# EasyEDA Pro project 2024年省赛.eprj

# Schematic Schematic1
Create Date: 2024-07-31; Page Name: P1; Project Name: 2024年省赛; Schematic Name: Schematic1; Update Date: 2024-08-01; Company: 嘉立创EDA; Page Size: A4; Version: V1.0
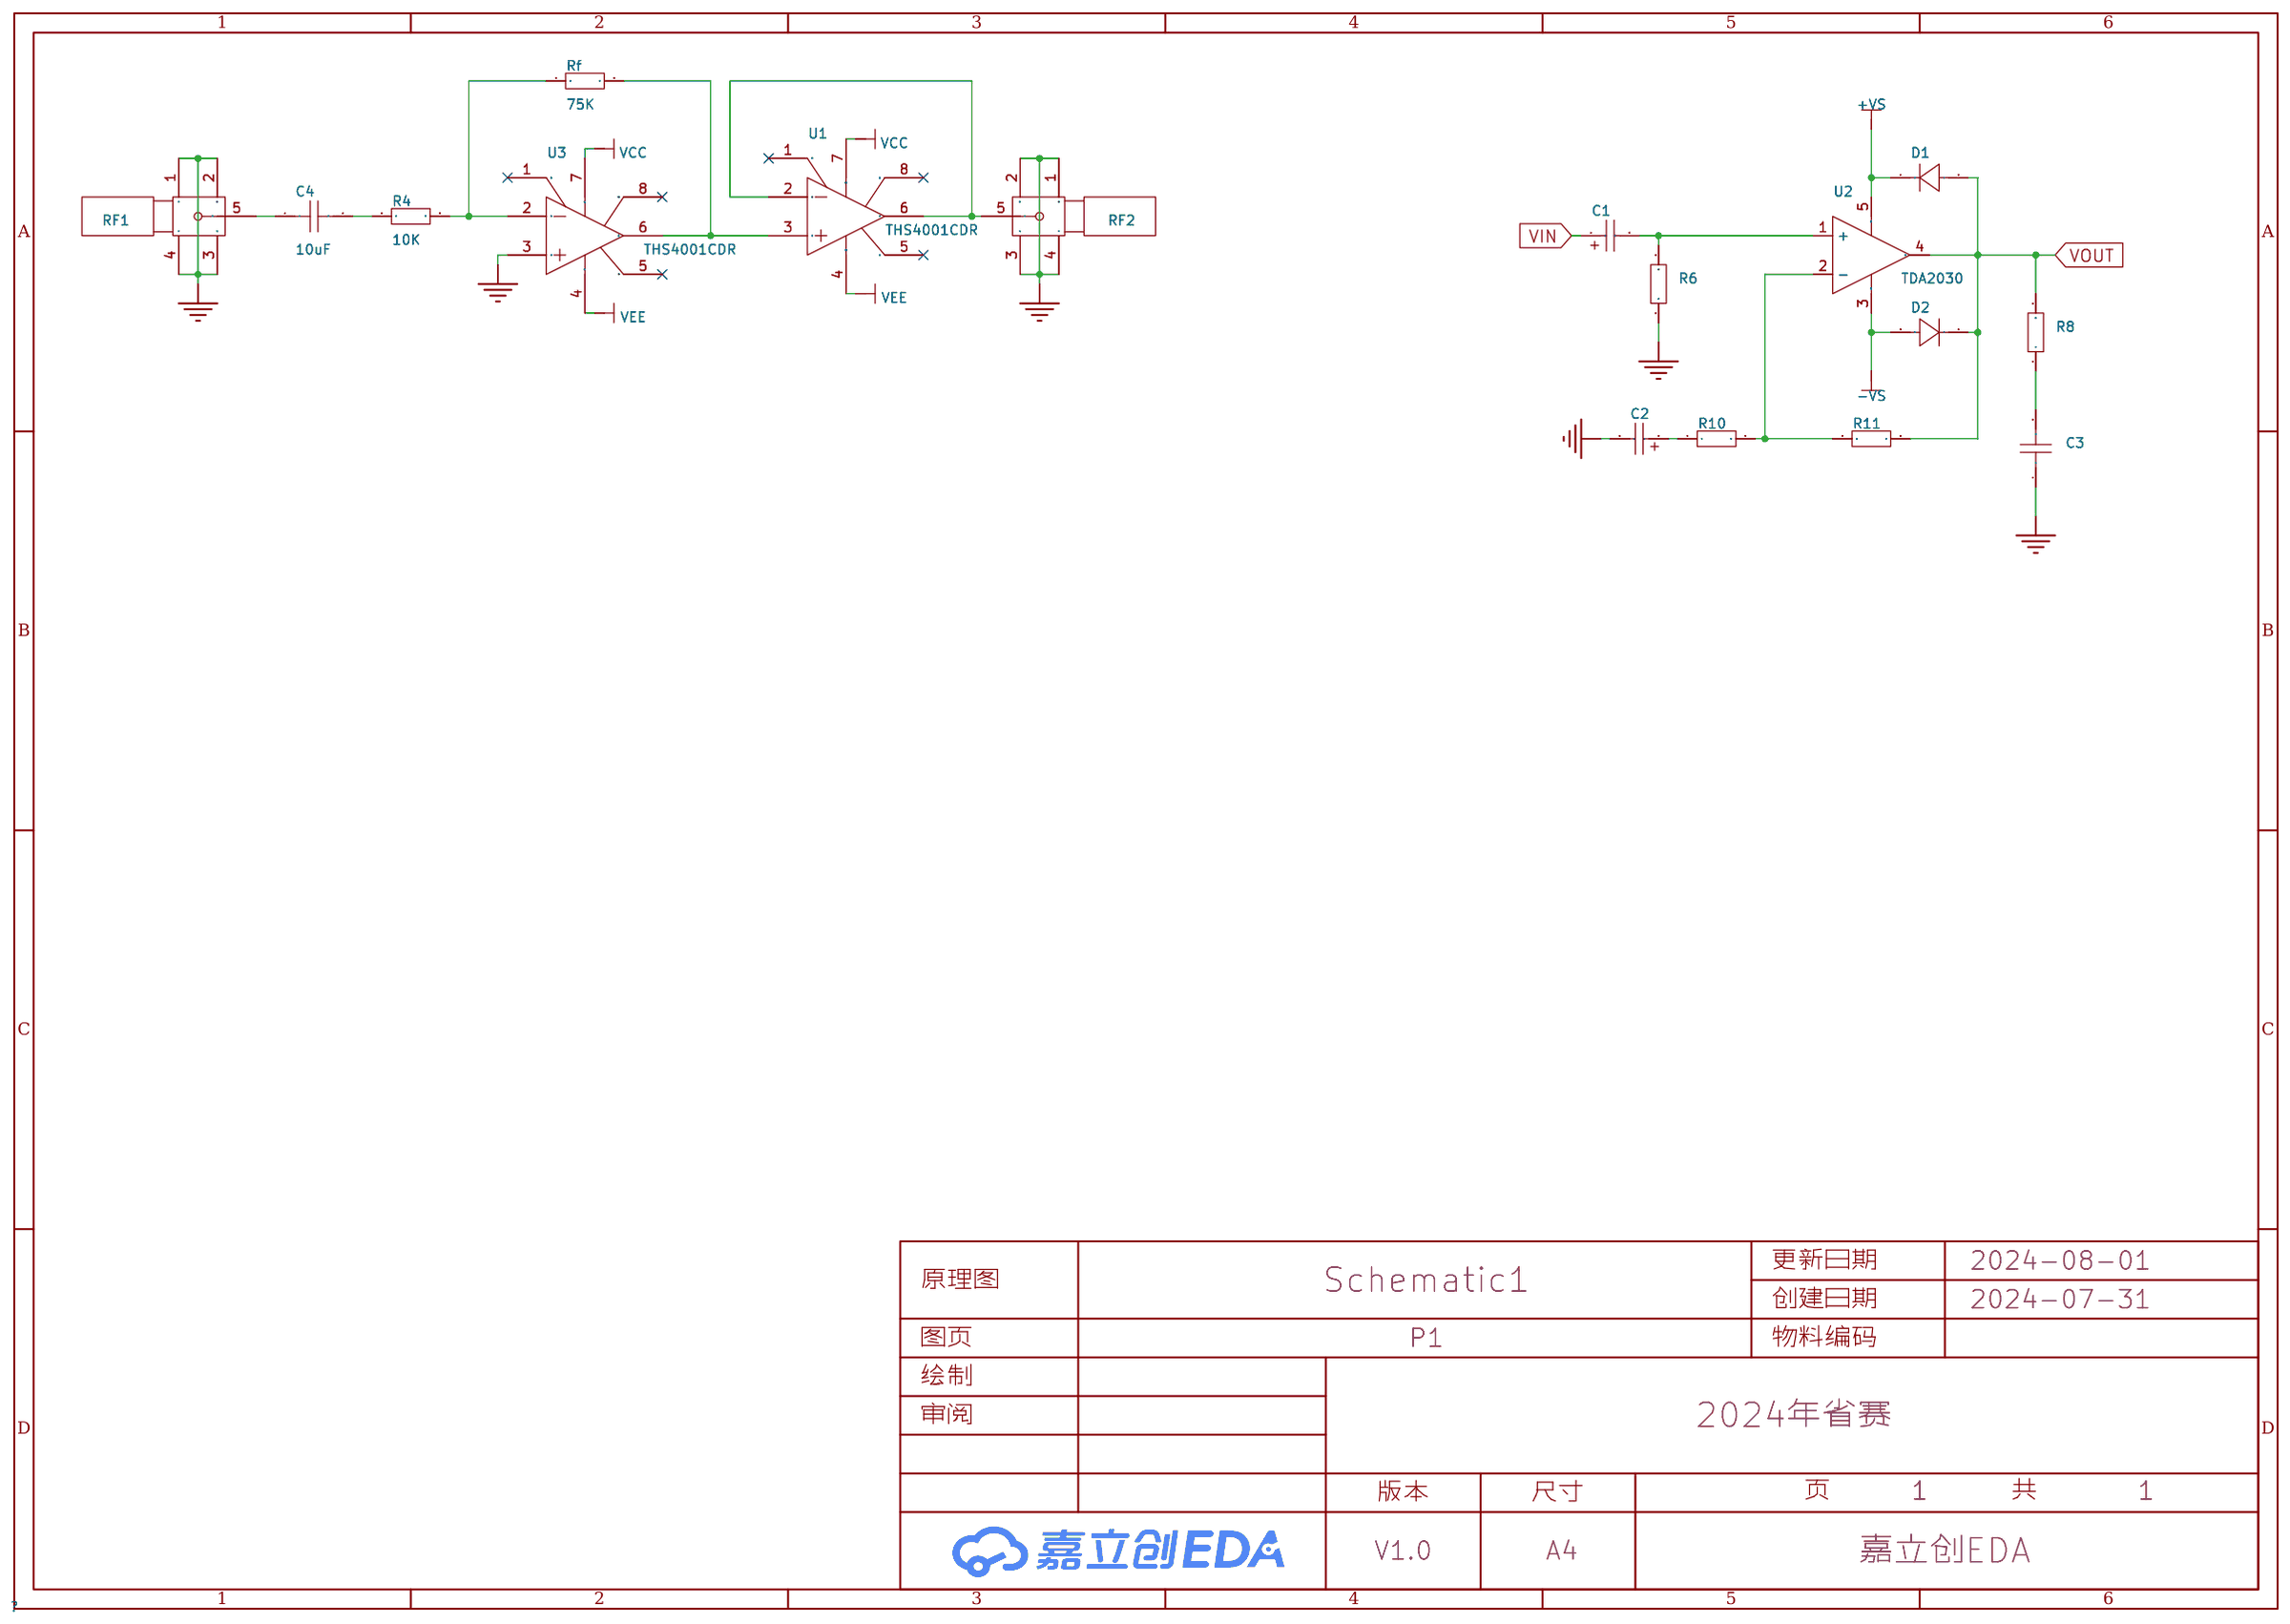
[diagram p0: schematic sheet]

## Parts
C1  1uF  [CAP-SMD_L3.2-W1.6-RD-C7171]
C2  22uF  [C_Ele_SMD_3x5.4mm]
C3  220n  [C0603]
C4  10uF  [C0603]
D1  -  [DO_1N4007]
D2  -  [DO_1N4007]
R4  10K  [R0603]
R6  22K  [R0603]
R8  1  [R0603]
R10  680  [R0603]
R11  10K  [R0603]
Rf  75K  [R0603]
RF1  BWSMA-KE-P001  [SMA-SMD_BWSMA-KE-P001]
RF2  BWSMA-KE-P001  [SMA-SMD_BWSMA-KE-P001]
U1  THS4001CDR  [SOIC-8_L4.9-W3.9-P1.27-LS6.0-BL]
U2  TDA2030  [TO-220-5_L10.2-W4.8-P1.70-TL]
U3  THS4001CDR  [SOIC-8_L4.9-W3.9-P1.27-LS6.0-BL]

## Library data of the parts
C1 = TAJA106K016RNJ: 容值:10uF;精度:±10%;额定电压:16V;等效串联电阻:3Ω@100kHz;; LCSC Part Name: 10uF ±10% 16V; Supplier Part: C7171; Manufacturer: Kyocera AVX; Supplier Footprint: CASE-A-3216; JLCPCB Part Class: Basic Part; Datasheet: https://atta.szlcsc.com/upload/public/pdf/source/20160107/1457707750344.pdf; Supplier: LCSC; Tolerance: ±10%; Rated Voltage: 16V; Equivalent Series Resistance(ESR): 3Ω@100kHz; Operating Temperature: -55℃~+125℃
C2 = C_Ele_SMD_3x5.4mm: Supplier Footprint: SMD,3x5.4mm
C3 C4 = CAP_0603: Supplier Footprint: 0603
D1 D2 = D_1N4007A: Supplier Footprint: DO-41
R4 R6 R8 R10 R11 Rf = Res_0603: Supplier Footprint: 0603
RF1 RF2 = BWSMA-KE-P001: 连接器类型:板端;接口类型:内孔;端口数量:1;接口直径:5.2mm;接口长度/高度:-;频率-最大值:-;射频系列:SMA;阻抗:50Ω;样式:偏脚;工作温度范围:-;; LCSC Part Name: 内孔 SMA 偏脚; Supplier Part: C496550; Manufacturer: BAT WIRELESS(蝙蝠无线); Supplier Footprint: 插件; JLCPCB Part Class: Extended Part; Datasheet: https://atta.szlcsc.com/upload/public/pdf/source/20240320/28FD502871C976DFF213ABFCF2A0ED51.pdf; Supplier: LCSC; Connector Type: 板端; Interface Type: 内孔; Number of Ports: 1; Interface Diameter: 5.2mm; RF Series: SMA; Impedance: 50Ω; Style: 偏脚
U1 U3 = THS4001CDR: 放大器数:单路;增益带宽积(GBP):270MHz;输入偏置电流(Ib):2.6uA;压摆率(SR):400V/us;带宽(-3db):270MHz;; Supplier Part: C2060779; Manufacturer: TI(德州仪器); Supplier Footprint: SOIC-8; JLCPCB Part Class: 扩展库; Datasheet: https://www.ti.com/cn/lit/gpn/ths4001; Supplier: LCSC; Number of Circuits: 单路; Gain Bandwidth Product(GBP): 270MHz; Current - Input Bias(Ib): 2.6uA; Slew Rate(SR): 400V/us; Output Current: 100mA; -3db Bandwidth: 270MHz; Operating Temperature: 0℃~+70℃
U2 = TDA2030_C5296731: TDA2030AL-TB5-T TDA2030 TDA2030L-TB5-T TFA2050; LCSC Part Name: TDA2030A; Supplier Part: C5296731; Manufacturer: JSMSEMI(杰盛微); Supplier Footprint: FZIP5; JLCPCB Part Class: 扩展库; Datasheet: https://atta.szlcsc.com/upload/public/pdf/source/20240105/2117F205BDD887DF1502453718A0C1E3.pdf; Supplier: LCSC

## Nets
GND: C2.2 C3.1 R6.1 RF1.1 RF1.2 RF1.3 RF1.4 RF2.1 RF2.2 RF2.3 RF2.4 U3.3(IN+)
VCC: U1.7(VCC+) U3.7(VCC+)
VEE: U1.4(VCC-) U3.4(VCC-)
VIN: C1.1
+VS: D1.1(K) U2.5(VCC+)
-VS: D2.2(A) U2.3(GND)
VOUT: D1.2(A) D2.1(K) R8.2 R11.2 U2.4(OUT)
Net-(C1-2): C1.2 R6.2 U2.1(+)
Net-(C2-1): C2.1 R10.1
Net-(C3-2): C3.2 R8.1
Net-(C4-1): C4.1 RF1.5
Net-(C4-2): C4.2 R4.1
Net-(R4-2): R4.2 Rf.1 U3.2(IN-)
Net-(R10-2): R10.2 R11.1 U2.2(-)
Net-(RF2-5): RF2.5 U1.2(IN-) U1.6(OUT)
Net-(Rf-2): Rf.2 U1.3(IN+) U3.6(OUT)

Not connected (* = marked no-connect by the designer): U1 1(NULL)* 5(NC)* 8(NULL)*; U3 1(NULL)* 5(NC)* 8(NULL)*
